# EAGLE design NixieDriver (EAGLE 9.6.2)
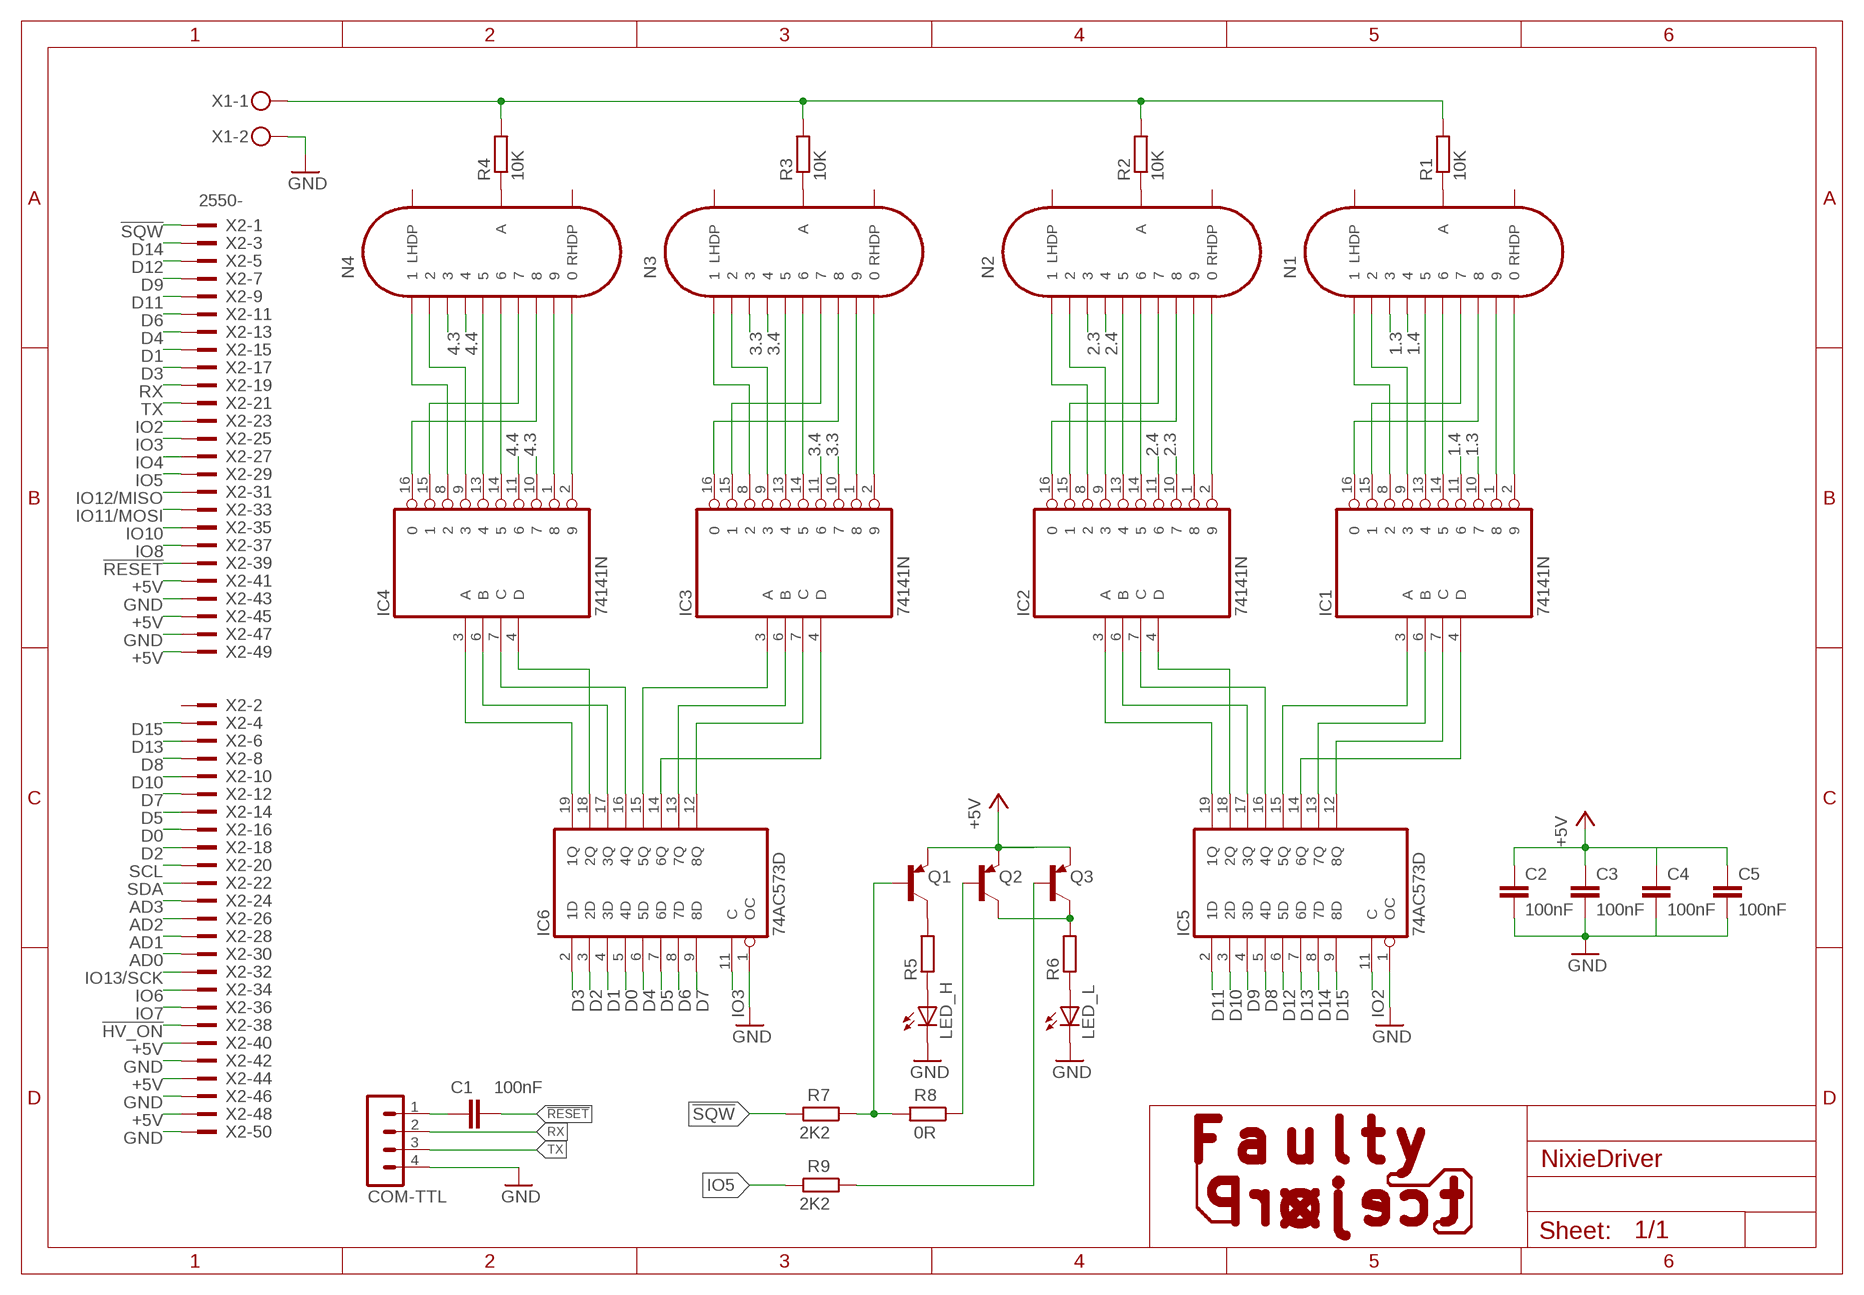
[diagram p0: schematic, sheet 1]

## Parts
C1  100nF  C-EUC1210  [C1210]
C2  100nF  C-EUC1210  [C1210]
C3  100nF  C-EUC1210  [C1210]
C4  100nF  C-EUC1210  [C1210]
C5  100nF  C-EUC1210  [C1210]
COM-TTL  MA04-1  [MA04-1]
IC1  74141N  [DIL16]
IC2  74141N  [DIL16]
IC3  74141N  [DIL16]
IC4  74141N  [DIL16]
IC5  74AC573D  [SO20W]
IC6  74AC573D  [SO20W]
LED_H  LED5MM  [LED5MM]
LED_L  LED5MM  [LED5MM]
N1  IN-14  [IN-14]
N2  IN-14  [IN-14]
N3  IN-14  [IN-14]
N4  IN-14  [IN-14]
Q1  BF621-PNP-SOT98-BCE  [SOT89-BCE]
Q2  BF621-PNP-SOT98-BCE  [SOT89-BCE]
Q3  BF621-PNP-SOT98-BCE  [SOT89-BCE]
R1  10K  R-EU_0309/V  [0309V]
R2  10K  R-EU_0309/V  [0309V]
R3  10K  R-EU_0309/V  [0309V]
R4  10K  R-EU_0309/V  [0309V]
R5  R-EU_M1206  [M1206]
R6  R-EU_M1206  [M1206]
R7  2K2  R-EU_M1406  [M1406]
R8  0R  R-EU_M1406  [M1406]
R9  2K2  R-EU_M1206  [M1206]
X1  MKDSN1,5/2-5,08  [MKDSN1,5/2-5,08]
X2  2550-  [PAK100/2500-50]

## Nets
1.0: IC1.2 N1.0
1.1: IC1.8 N1.1
1.2: IC1.9 N1.2
1.3: IC1.10 N1.3
1.4: IC1.11 N1.4
1.5: IC1.13 N1.5
1.6: IC1.14 N1.6
1.7: IC1.15 N1.7
1.8: IC1.16 N1.8
1.9: IC1.1 N1.9
2.0: IC2.2 N2.0
2.1: IC2.8 N2.1
2.2: IC2.9 N2.2
2.3: IC2.10 N2.3
2.4: IC2.11 N2.4
2.5: IC2.13 N2.5
2.6: IC2.14 N2.6
2.7: IC2.15 N2.7
2.8: IC2.16 N2.8
2.9: IC2.1 N2.9
3.0: IC3.2 N3.0
3.1: IC3.8 N3.1
3.2: IC3.9 N3.2
3.3: IC3.10 N3.3
3.4: IC3.11 N3.4
3.5: IC3.13 N3.5
3.6: IC3.14 N3.6
3.7: IC3.15 N3.7
3.8: IC3.16 N3.8
3.9: IC3.1 N3.9
4.0: IC4.2 N4.0
4.1: IC4.8 N4.1
4.2: IC4.9 N4.2
4.3: IC4.10 N4.3
4.4: IC4.11 N4.4
4.5: IC4.13 N4.5
4.6: IC4.14 N4.6
4.7: IC4.15 N4.7
4.8: IC4.16 N4.8
4.9: IC4.1 N4.9
!HV_ON: X2.38
!RESET: C1.2 X2.39
!SQW: R7.2 X2.1
+5V: C2.1 C3.1 C4.1 C5.1 Q1.E Q2.E Q3.E X2.40 X2.41 X2.44 X2.45 X2.48 X2.49
AD0: X2.30
AD1: X2.28
AD2: X2.26
AD3: X2.24
D0: IC6.5(4D) X2.16
D1: IC6.4(3D) X2.15
D2: IC6.3(2D) X2.18
D3: IC6.2(1D) X2.17
D4: IC6.6(5D) X2.13
D5: IC6.7(6D) X2.14
D6: IC6.8(7D) X2.11
D7: IC6.9(8D) X2.12
D8: IC5.5(4D) X2.8
D9: IC5.4(3D) X2.7
D10: IC5.3(2D) X2.10
D11: IC5.2(1D) X2.9
D12: IC5.6(5D) X2.5
D13: IC5.7(6D) X2.6
D14: IC5.8(7D) X2.3
D15: IC5.9(8D) X2.4
GND [gnd]: C2.2 C3.2 C4.2 C5.2 COM-TTL.4 IC5.1(OC) IC6.1(OC) LED_H.K(C) LED_L.K(C) X1.2 X2.42 X2.43 X2.46 X2.47 X2.50
HIGH_VOLTAGE: R1.2 R2.2 R3.2 R4.2 X1.1
IO2: IC5.11(C) X2.23
IO3: IC6.11(C) X2.25
IO4: X2.27
IO5: R9.2 X2.29
IO6: X2.34
IO7: X2.36
IO8: X2.37
IO10: X2.35
IO11/MOSI: X2.33
IO12/MISO: X2.31
IO13/SCK: X2.32
N$1: IC2.3(A) IC5.19(1Q)
N$2: IC2.4(D) IC5.18(2Q)
N$3: IC2.6(B) IC5.17(3Q)
N$4: IC2.7(C) IC5.16(4Q)
N$5: IC1.3(A) IC5.15(5Q)
N$6: IC1.4(D) IC5.14(6Q)
N$7: IC1.6(B) IC5.13(7Q)
N$8: IC1.7(C) IC5.12(8Q)
N$9: IC4.3(A) IC6.19(1Q)
N$10: IC4.4(D) IC6.18(2Q)
N$11: IC4.6(B) IC6.17(3Q)
N$12: IC4.7(C) IC6.16(4Q)
N$13: IC3.3(A) IC6.15(5Q)
N$14: IC3.4(D) IC6.14(6Q)
N$15: IC3.6(B) IC6.13(7Q)
N$16: IC3.7(C) IC6.12(8Q)
N$17: Q1.C R5.2
N$18: LED_H.A R5.1
N$19: Q2.C Q3.C R6.2
N$21: LED_L.A R6.1
N$22: Q1.B R7.1 R8.2
N$23: C1.1 COM-TTL.1
N$24: Q2.B R8.1
N$76: N1.A R1.1
N$77: N2.A R2.1
N$78: N3.A R3.1
N$79: N4.A R4.1
N$88: Q3.B R9.1
RX: COM-TTL.2 X2.19
SCL: X2.20
SDA: X2.22
TX: COM-TTL.3 X2.21
Unconnected: N1.LHDP N1.RHDP N2.LHDP N2.RHDP N3.LHDP N3.RHDP N4.LHDP N4.RHDP X2.2

## Power pins joined to a net without a drawn wire
+5V: IC1.5(VCC) IC2.5(VCC) IC3.5(VCC) IC4.5(VCC) IC5.20(VCC) IC6.20(VCC)
GND: IC1.12(GND) IC2.12(GND) IC3.12(GND) IC4.12(GND) IC5.10(GND) IC6.10(GND)

## Library data of the parts
C1-C5 = rcl:C-EU: CAPACITOR, European symbol
COM-TTL = con-lstb:MA04-1: PIN HEADER; OC_FARNELL: unknown; OC_NEWARK: unknown
IC1-IC4 = 74xx-eu:74*141: BCD to decimal DECODER/DRIVER
IC5 IC6 = 74xx-eu:74*573: 8-bit D latch BUS DRIVER
LED_H LED_L = led:LED: LED OSRAM: - CHIPLED LG R971, LG N971, LY N971, LG Q971, LY Q971, LO R971, LY R971 LH N974, LH R974 LS Q976, LO Q976, LY Q976 LO Q996 - Hyper CHIPLED LW Q18S LB Q993, LB Q99A, LB R99A - SideLED LS A670, LO A670, LY A670, LG A670, LP A670 LB A673, LV A673, LT A673, LW A673 LH A674 LY A675 LS A676, LA A676, LO A676, LY A676, LW A676 LS A679, LY A679, LG A679 - Hyper Micro SIDELED® LS Y876, LA Y876, LO Y876, LY Y876 LT Y87S - SmartLED LW L88C, LW L88S LB L89C, LB L89S, LG L890 LS L89K, LO L89K, LY L89K LS L896, LA L896, LO L896, LY L896 - TOPLED LS T670, LO T670, LY T670, LG T670, LP T670 LSG T670, LSP T670, LSY T670, LOP T670, LYG T670 LG T671, LOG T671, LSG T671 LB T673, LV T673, LT T673, LW T673 LH T674 LS T676, LA T676, LO T676, LY T676, LB T676, LH T676, LSB T676, LW T676 LB T67C, LV T67C, LT T67C, LS T67K, LO T67K, LY T67K, LW E67C LS E67B, LA E67B, LO E67B, LY E67B, LB E67C, LV E67C, LT E67C LW T67C LS T679, LY T679, LG T679 LS T770, LO T770, LY T770, LG T770, LP T770 LB T773, LV T773, LT T773, LW T773 LH T774 LS E675, LA E675, LY E675, LS T675 LS T776, LA T776, LO T776, LY T776, LB T776 LHGB T686 LT T68C, LB T68C - Hyper Mini TOPLED® LB M676 - Mini TOPLED Santana® LG M470 LS M47K, LO M47K, LY M47K Source: http://www.osram.convergy.de LUXEON: - LUMILED® LXK2-PW12-R00, LXK2-PW12-S00, LXK2-PW14-U00, LXK2-PW14-V00 LXK2-PM12-R00, LXK2-PM12-S00, LXK2-PM14-U00 LXK2-PE12-Q00, LXK2-PE12-R00, LXK2-PE12-S00, LXK2-PE14-T00, LXK2-PE14-U00 LXK2-PB12-K00, LXK2-PB12-L00, LXK2-PB12-M00, LXK2-PB14-N00, LXK2-PB14-P00, LXK2-PB14-Q00 LXK2-PR12-L00, LXK2-PR12-M00, LXK2-PR14-Q00, LXK2-PR14-R00 LXK2-PD12-Q00, LXK2-PD12-R00, LXK2-PD12-S00 LXK2-PH12-R00, LXK2-PH12-S00 LXK2-PL12-P00, LXK2-PL12-Q00, LXK2-PL12-R00 Source: www.luxeon.com KINGBRIGHT: KA-3528ASYC Source: www.kingbright.com
N1-N4 = russian-nixies:IN-14: IN-14: medium numeric frontview nixie tube
Q1-Q3 = transistor:*-PNP-: PNP Transistror
R1-R9 = rcl:R-EU_: RESISTOR, European symbol
X1 = con-phoenix-508:MKDSN1,5/2-5,08: MKDSN 1,5/ 2-5,08 Printklemme Nennstrom: 13,5 A Nennspannung: 250 V Rastermaß: 5,08 mm Polzahl: 2 Anschlussart: Schraubanschluss Montage: Löten Anschlussrichtung Leiter/Platine: 0 ° Artikelnummer: 1729128 Source: http://eshop.phoenixcontact.com .. 1729128.pdf
X2 = con-3m:2550-: 3M (TM) Pak 100 4-Wall Header Source: 3M; OC_FARNELL: unknown; OC_NEWARK: unknown

## Net classes
0 default: width 0.254 mm, clearance 0.254 mm
2 gnd: width 0.305 mm, drill 0.559 mm, clearance 0.254 mm
3 usbvcc: width 0.508 mm, drill 0.61 mm, clearance 0.254 mm

## Board
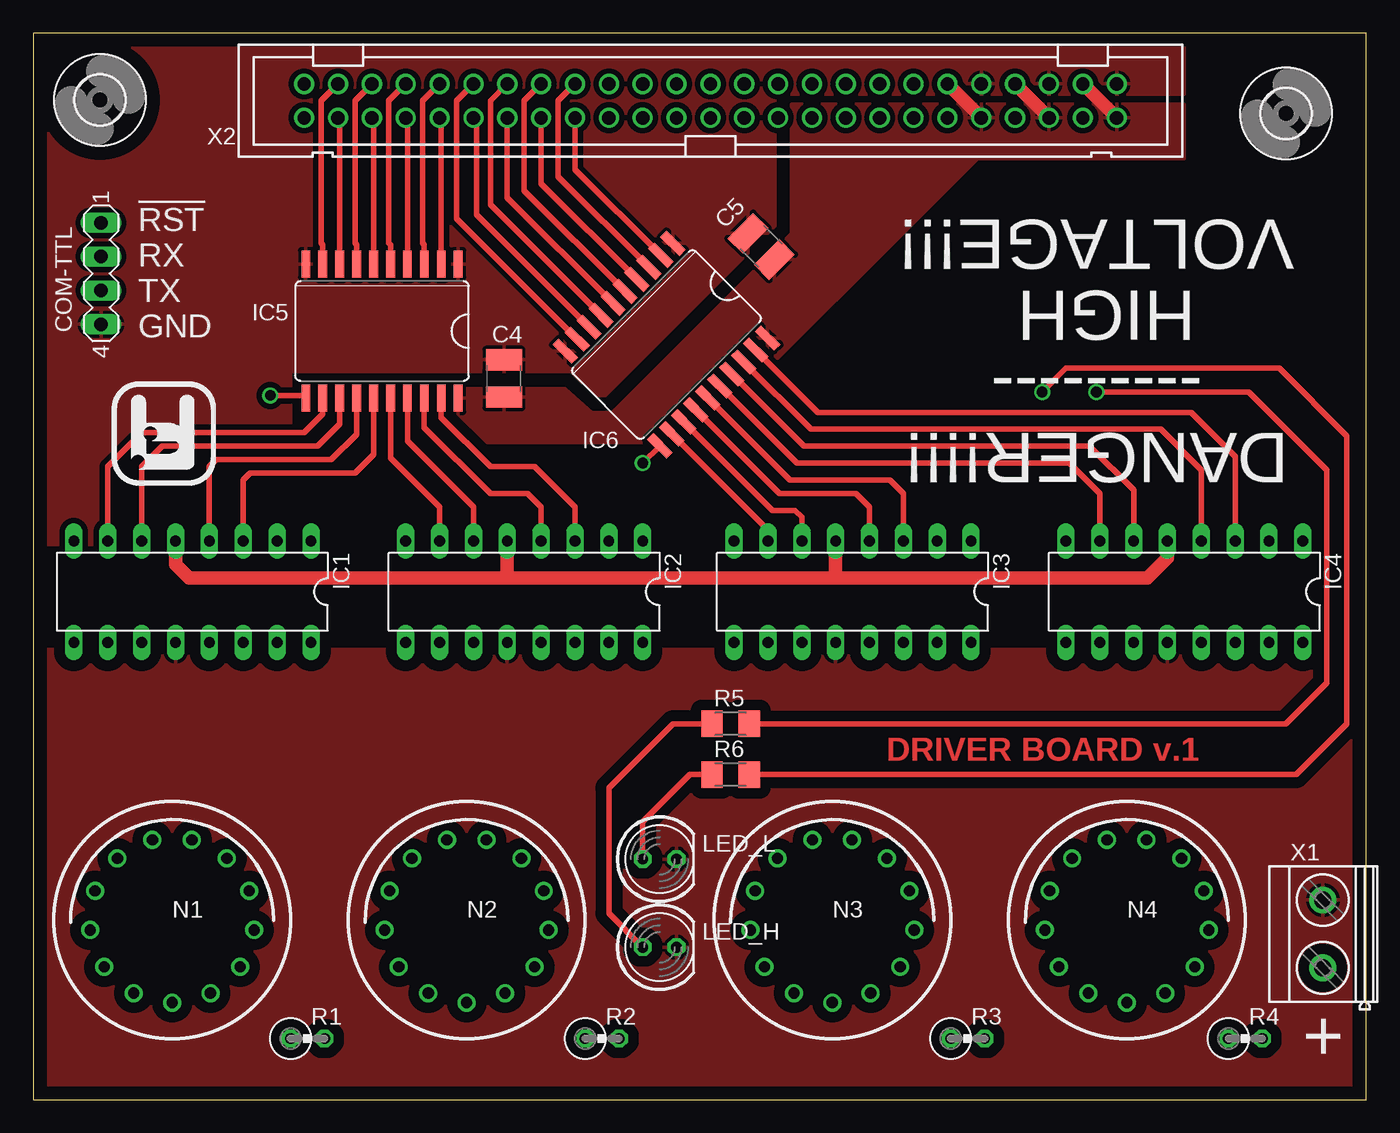
[diagram p1: board, top side]
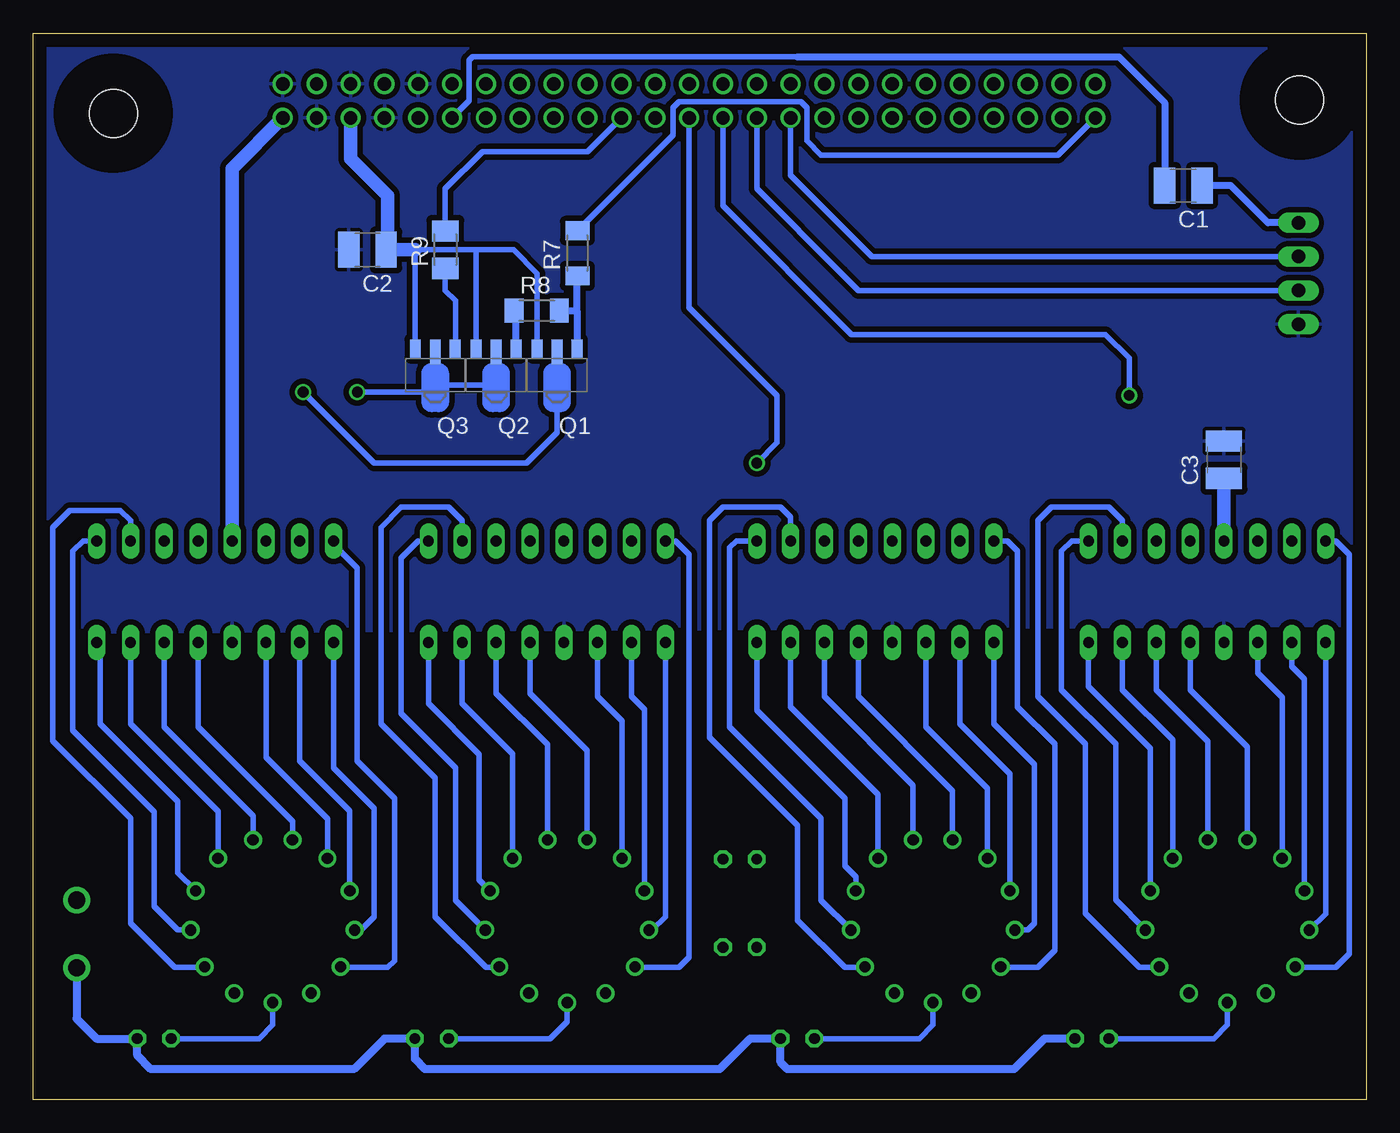
[diagram p2: board, bottom side, seen from below]

Size 100 x 80 mm. Coordinates in mm from the lower left corner, seen from the top.
Outline: 0,0 100,0 100,80 0,80 0,0
Copper layers (1*16): Top 0.035mm / dielectric 1.5mm / Bottom 0.035mm
Design rules "default": minimum track width 10mil, minimum drill 24mil, track to track 8mil, track to pad 8mil, pad to pad 8mil, via to via 8mil, smd to smd 8mil, copper to edge 40mil, drill to drill 8mil, minimum pad ring 10mil, minimum via ring 8mil, stop-mask expansion 4mil, vias tented up to drill 0mil, thermal gap 10mil

### Footprints (pad centres in the part's own frame; a part is rotated, then mirrored left to right if it is on the bottom)
C1210 = smd 1.6 x 2.7: 1 -1.4,0; 2 1.4,0
MA04-1 = drill 1.016 long: 1 -3.81,0; 2 -1.27,0; 3 1.27,0; 4 3.81,0
DIL16 = drill 0.813 long: 1 -8.89,-3.81; 2 -6.35,-3.81; 3 -3.81,-3.81; 4 -1.27,-3.81; 5 1.27,-3.81; 6 3.81,-3.81; 7 6.35,-3.81; 8 8.89,-3.81; 9 8.89,3.81; 10 6.35,3.81; 11 3.81,3.81; 12 1.27,3.81; 13 -1.27,3.81; 14 -3.81,3.81; 15 -6.35,3.81; 16 -8.89,3.81
SO20W = smd 0.66 x 2.032: 1 -5.715,-5.029; 2 -4.445,-5.029; 3 -3.175,-5.029; 4 -1.905,-5.029; 5 -0.635,-5.029; 6 0.635,-5.029; 7 1.905,-5.029; 8 3.175,-5.029; 9 4.445,-5.029; 10 5.715,-5.029; 11 5.715,5.029; 12 4.445,5.029; 13 3.175,5.029; 14 1.905,5.029; 15 0.635,5.029; 16 -0.635,5.029; 17 -1.905,5.029; 18 -3.175,5.029; 19 -4.445,5.029; 20 -5.715,5.029
LED5MM = drill 0.813 octagon: A -1.27,0; K 1.27,0
IN-14 = drill 0.84: 0 5.094,-3.516; 1 -5.094,-3.516; 2 -6.145,-0.746; 3 -5.788,2.195; 4 -4.105,4.633; 5 -1.481,6.01; 6 1.481,6.01; 7 4.105,4.633; 8 5.788,2.195; 9 6.145,-0.746; A 0,-6.19; LHDP 2.877,-5.481; RHDP -2.877,-5.481
SOT89-BCE = smd 0.8 x 1.4: B -1.499,-1.981; E 1.499,-1.981 | smd 0.8 x 1.9: C 0,-1.727
0309V = drill 0.813 octagon: 1 -1.27,0; 2 1.27,0
M1206 = smd 1.6 x 2: 1 -1.4,0; 2 1.4,0
M1406 = smd 1.4 x 1.8: 1 -1.7,0; 2 1.7,0
3,6 = hole 3.6: 0,0
MKDSN1,5/2-5,08 = drill 1.3 pad 2: 1 -2.561,0.025; 2 2.519,0.025
PAK100/2500-50 = drill 1 pad 1.422: 1 -30.48,-1.27; 2 -30.48,1.27; 3 -27.94,-1.27; 4 -27.94,1.27; 5 -25.4,-1.27; 6 -25.4,1.27; 7 -22.86,-1.27; 8 -22.86,1.27; 9 -20.32,-1.27; 10 -20.32,1.27; 11 -17.78,-1.27; 12 -17.78,1.27; 13 -15.24,-1.27; 14 -15.24,1.27; 15 -12.7,-1.27; 16 -12.7,1.27; 17 -10.16,-1.27; 18 -10.16,1.27; 19 -7.62,-1.27; 20 -7.62,1.27; 21 -5.08,-1.27; 22 -5.08,1.27; 23 -2.54,-1.27; 24 -2.54,1.27; 25 0,-1.27; 26 0,1.27; 27 2.54,-1.27; 28 2.54,1.27; 29 5.08,-1.27; 30 5.08,1.27; 31 7.62,-1.27; 32 7.62,1.27; 33 10.16,-1.27; 34 10.16,1.27; 35 12.7,-1.27; 36 12.7,1.27; 37 15.24,-1.27; 38 15.24,1.27; 39 17.78,-1.27; 40 17.78,1.27; 41 20.32,-1.27; 42 20.32,1.27; 43 22.86,-1.27; 44 22.86,1.27; 45 25.4,-1.27; 46 25.4,1.27; 47 27.94,-1.27; 48 27.94,1.27; 49 30.48,-1.27; 50 30.48,1.27

### Placement (x,y rotation side)
C1  13.72,68.58 180 bottom
C2  74.93,63.75 180 bottom
C3  10.67,48.01 90 bottom
C4  35.31,54.1 90 top
C5  54.61,64.01 135 top
COM-TTL  5.08,61.98 270 top
IC1  11.94,38.1 180 top
IC2  36.83,38.1 180 top
IC3  61.47,38.1 180 top
IC4  86.36,38.1 180 top
IC5  26.16,57.66 180 top
IC6  47.5,56.64 225 top
LED_H  46.99,11.43 0 top
LED_L  46.99,18.03 0 top
N1  10.41,13.46 0 top
N2  32.51,13.46 0 top
N3  59.94,13.46 0 top
N4  82.04,13.46 0 top
Q1  60.71,54.36 180 bottom
Q2  65.28,54.36 180 bottom
Q3  69.85,54.36 180 bottom
R1  20.57,4.57 0 top
R2  42.67,4.57 0 top
R3  70.1,4.57 0 top
R4  90.93,4.57 0 top
R5  52.32,28.19 0 top
R6  52.32,24.38 0 top
R7  59.18,63.5 90 bottom
R8  62.23,59.18 0 bottom
R9  69.09,63.75 90 bottom
U$1  [3,6]  5,75 0 top
U$3  [3,6]  94,74 0 top
X1  96.77,12.45 90 top
X2  50.8,74.93 0 top

### Tracks (layer width: path | path; a pad name or v marks a point on that pad's centre or on a via)
1.0
  Bottom 0.406: IC1.2 18.29,43.43 19.3,44.45 23.62,44.45 24.64,43.43 24.64,30.23 21.08,26.67 21.08,13.97 17.02,9.91 15.55,9.91 N1.0
1.1
  Bottom 0.406: IC1.8 2.29,41.91 1.27,40.89 1.27,10.92 2.29,9.91 5.28,9.91 N1.1
1.2
  Bottom 0.406: IC1.9 3.05,13.94 N1.2
1.3
  Bottom 0.406: N1.3 4.63,31.55 5.59,32.51 IC1.10
1.4
  Bottom 0.406: N1.4 6.31,30.18 8.13,32 IC1.11
1.5
  Bottom 0.406: N1.5 8.93,26.46 13.21,30.73 IC1.13
1.6
  Bottom 0.406: N1.6 11.89,26.88 15.75,30.73 IC1.14
1.7
  Bottom 0.406: N1.7 14.52,26.96 18.29,30.73 IC1.15
1.8
  Bottom 0.406: N1.8 16.2,26.36 20.83,30.99 IC1.16
1.9
  Bottom 0.406: N1.9 16.56,12.75 18.8,14.99 18.8,26.67 22.86,30.73 22.86,41.15 22.1,41.91 IC1.1
2.0
  Bottom 0.406: N2.0 37.65,9.91 39.12,9.91 42.67,13.46 42.67,20.57 49.28,27.18 49.28,43.43 48.26,44.45 43.94,44.45 43.18,43.69 IC2.2
2.1
  Bottom 0.406: IC2.8 26.92,41.91 26.16,41.15 26.16,29.46 23.37,26.67 23.37,11.18 24.64,9.91 27.38,9.91 N2.1
2.2
  Bottom 0.406: N2.2 25.38,12.72 24.89,13.21 24.89,25.15 27.94,28.19 IC2.9
2.3
  Bottom 0.406: N2.3 26.72,24.44 30.48,28.19 IC2.10
2.4
  Bottom 0.406: N2.4 28.41,23.33 33.02,27.94 IC2.11
2.5
  Bottom 0.406: N2.5 31.03,23.16 38.1,30.23 IC2.13
2.6
  Bottom 0.406: N2.6 33.99,23.58 40.64,30.23 IC2.14
2.7
  Bottom 0.406: N2.7 36.62,22.9 43.18,29.46 IC2.15
2.8
  Bottom 0.406: N2.8 38.3,16.71 39.12,17.53 39.12,22.61 45.72,29.21 IC2.16
2.9
  Bottom 0.406: N2.9 40.89,14.95 40.89,21.08 47.75,27.94 47.75,41.4 47.24,41.91 IC2.1
3.0
  Bottom 0.406: N3.0 65.08,9.91 66.04,9.91 69.85,13.72 69.85,24.13 73.91,28.19 73.91,42.93 72.39,44.45 68.83,44.45 67.82,43.43 IC3.2
3.1
  Bottom 0.406: IC3.8 51.82,41.91 50.8,40.89 50.8,10.67 51.56,9.91 54.81,9.91 N3.1
3.2
  Bottom 0.406: N3.2 53.58,12.72 52.58,13.72 IC3.9
3.3
  Bottom 0.406: N3.3 54.16,29.26 55.12,30.23 IC3.10
3.4
  Bottom 0.406: N3.4 55.84,28.41 57.66,30.23 IC3.11
3.5
  Bottom 0.406: N3.5 58.46,26.2 62.74,30.48 IC3.13
3.6
  Bottom 0.406: N3.6 61.42,26.63 65.28,30.48 IC3.14
3.7
  Bottom 0.406: N3.7 64.05,25.95 67.82,29.72 IC3.15
3.8
  Bottom 0.406: N3.8 66.55,16.47 66.55,25.91 70.36,29.72 IC3.16
3.9
  Bottom 0.406: N3.9 68.33,14.95 68.33,24.89 72.39,28.96 72.39,40.64 71.12,41.91 IC3.1
4.0
  Bottom 0.406: N4.0 87.18,9.91 89.41,9.91 92.71,13.21 92.71,21.08 98.55,26.92 98.55,42.93 97.28,44.2 93.47,44.2 92.71,43.43 IC4.2
4.1
  Bottom 0.406: N4.1 76.91,9.91 73.41,9.91 72.9,10.41 72.9,22.61 75.69,25.4 75.69,39.88 77.72,41.91 IC4.8
4.2
  Bottom 0.406: IC4.9 77.47,24.89 74.42,21.84 74.42,13.72 75.42,12.72 N4.2
4.3
  Bottom 0.406: IC4.10 80.01,25.4 76.25,21.64 N4.3
4.4
  Bottom 0.406: IC4.11 82.55,25.65 77.94,21.04 N4.4
4.5
  Bottom 0.406: IC4.13 87.63,27.94 80.56,20.87 N4.5
4.6
  Bottom 0.406: IC4.14 90.17,27.94 83.52,21.29 N4.6
4.7
  Bottom 0.406: IC4.15 92.71,28.19 86.15,21.63 N4.7
4.8
  Bottom 0.406: IC4.16 95,34.04 95,28.19 89.15,22.35 89.15,17.02 87.83,15.69 N4.8
4.9
  Bottom 0.406: IC4.1 96.27,41.91 97.03,41.15 97.03,27.69 90.93,21.59 90.93,14.48 89.17,12.72 N4.9
!RESET
  Bottom 0.406: 42.67,78.23 67.06,78.23 67.31,77.98 67.31,74.93 X2.39
  Bottom 0.508: 42.67,78.23 18.54,78.23 15.12,74.81 C1.2
!SQW
  Bottom 0.406: R7.2 52.01,72.37 52.01,74.42 51.56,74.87 42.42,74.87 41.97,74.42 41.97,71.94 40.89,70.87 23.11,70.87 X2.1
+5V
  Top 1.016: IC1.5 10.67,40.13 11.68,39.12 35.56,39.12 | 35.56,39.12 60.2,39.12 | 60.2,39.12 83.57,39.12 85.09,40.64 IC4.5 | IC3.5 60.2,39.12 | IC2.5 35.56,39.12 | X2.40 X2.41 | X2.44 X2.45 | X2.48 X2.49
  Bottom 0.406: Q3.E 71.35,63.75 | Q2.E 66.78,63.75 | 66.78,63.75 71.35,63.75 | 66.78,63.75 63.98,63.75 62.2,61.98 Q1.E | 71.37,63.75 71.35,63.75
  Bottom 1.016: X2.49 85.09,69.85 IC4.5 | IC1.5 C3.1 | X2.45 76.2,70.61 73.41,67.82 73.41,63.88 C2.1 71.37,63.75
  pour Top (isolate 0.406): 86.36,74.68 86.36,70.61 70.87,70.61 49.53,49.28 34.04,49.28 31.75,51.56 31.75,53.34 39.91,53.34 41.91,51.56 43.43,51.56 56.9,65.02 56.9,74.68
D0
  Top 0.406: X2.16 36.83,74.93 36.83,68.21 IC6.5
D1
  Top 0.406: X2.15 38.1,68.73 IC6.4
D2
  Top 0.406: X2.18 39.37,74.93 39.37,69.26 IC6.3
D3
  Top 0.406: X2.17 40.64,69.79 IC6.2
D4
  Top 0.406: X2.13 35.56,67.68 IC6.6
D5
  Top 0.406: X2.14 34.29,74.93 34.29,67.16 IC6.7
D6
  Top 0.406: X2.11 33.27,73.41 33.27,66.38 IC6.8
D7
  Top 0.406: X2.12 31.75,74.93 31.75,66.1 IC6.9
D8
  Top 0.406: X2.8 26.67,74.93 26.67,64.26 26.8,64.14 IC5.5
D9
  Top 0.406: X2.7 28.07,73.53 IC5.4
D10
  Top 0.406: X2.10 29.21,74.93 29.21,64.26 29.34,64.14 IC5.3
D11
  Top 0.406: X2.9 30.61,73.53 IC5.2
D12
  Top 0.406: X2.5 25.53,73.53 IC5.6
D13
  Top 0.406: X2.6 24.13,74.93 24.13,64.26 24.26,64.14 IC5.7
D14
  Top 0.406: X2.3 22.99,73.53 IC5.8
D15
  Top 0.406: X2.4 21.59,74.93 21.59,64.26 21.72,64.14 IC5.9
GND
  pour Bottom (isolate 0.406): 0,35.56 99.82,35.05 99.82,80.01 0,80.01
  pour Top (isolate 0.813): 0,0 99.82,0 99.82,33.78 0,33.78
  pour Top (isolate 0.406): 0,80.01 86.36,80.01 86.36,75.44 55.63,75.44 55.63,65.53 42.93,52.83 42.16,52.83 40.35,54.61 19.3,54.61 19.3,41.66 0,41.66
HIGH_VOLTAGE
  Bottom 0.61: X1.1 96.75,6.07 95.25,4.57 R4.2 92.2,3.3 91.19,2.29 75.95,2.29 73.66,4.57 R3.2 71.37,3.05 70.61,2.29 48.51,2.29 46.23,4.57 R2.2 43.94,2.79 43.43,2.29 26.42,2.29 24.13,4.57 R1.2
IO2  (via drill 0.8)
  Top 0.406: v17.78,52.83 20.24,52.83 IC5.11
  Bottom 0.406: X2.23 48.26,67.06 38.61,57.4 19.56,57.4 17.78,55.63 v17.78,52.83
IO3  (via drill 0.8 pad 1.02)
  Top 0.406: IC6.11 | v45.72,47.75 | v45.72,47.75 IC6.11
  Bottom 0.406: X2.25 50.8,59.44 44.2,52.83 44.2,49.28 v45.72,47.75
IO5
  Bottom 0.406: X2.29 58.42,71.12 66.29,71.12 69.09,68.33 R9.2
N$1
  Top 0.406: IC5.19 30.61,51.18 34.29,47.5 37.59,47.5 40.64,44.45 IC2.3
N$2
  Top 0.406: IC5.18 29.34,50.42 34.29,45.47 37.08,45.47 38.1,44.45 IC2.4
N$3
  Top 0.406: IC5.17 28.07,49.4 33.02,44.45 IC2.6
N$4
  Top 0.406: IC5.16 26.8,48.13 30.48,44.45 IC2.7
N$5
  Top 0.406: IC5.15 25.53,48.39 24.13,46.99 16.26,46.99 15.75,46.48 IC1.3
N$6
  Top 0.406: IC5.14 24.26,49.91 22.35,48.01 13.72,48.01 13.21,47.5 IC1.4
N$7
  Top 0.406: IC5.13 22.99,50.67 21.34,49.02 9.65,49.02 8.13,47.5 IC1.6
N$8
  Top 0.406: IC5.12 21.72,51.44 20.32,50.04 8.13,50.04 5.59,47.5 IC1.7
N$9
  Top 0.406: IC4.3 90.17,48.26 86.87,51.56 58.86,51.56 IC6.19
N$10
  Top 0.406: IC4.4 87.63,47.24 84.58,50.29 58.34,50.29 IC6.18
N$11
  Top 0.406: IC4.6 82.55,45.72 79.25,49.02 57.81,49.02 IC6.17
N$12
  Top 0.406: IC4.7 80.01,45.47 77.72,47.75 57.29,47.75 IC6.16
N$13
  Top 0.406: IC3.3 65.28,45.47 64.26,46.48 56.76,46.48 IC6.15
N$14
  Top 0.406: IC3.4 62.74,44.45 61.72,45.47 55.98,45.47 IC6.14
N$15
  Top 0.406: IC3.6 57.66,43.69 57.15,44.2 55.45,44.2 IC6.13
N$16
  Top 0.406: IC3.7 55.12,42.74 IC6.12
N$17  (via drill 0.8)
  Top 0.406: R5.2 93.98,28.19 97.03,31.24 97.03,47.24 91.19,53.09 v79.76,53.09
  Bottom 0.406: v79.76,53.09 74.42,47.75 62.99,47.75 60.71,50.04 Q1.C
N$18
  Top 0.406: R5.1 48.01,28.19 43.18,23.37 43.18,13.97 LED_H.A
N$19  (via drill 0.8)
  Top 0.406: R6.2 94.74,24.38 98.55,28.19 98.55,49.78 93.47,54.86 77.47,54.86 v75.69,53.09
  Bottom 0.406: Q2.C 65.28,54.1 65.79,53.59 69.09,53.59 69.47,53.98 | 69.47,53.98 69.85,54.36 Q3.C | v75.69,53.09 70.36,53.09 69.47,53.98
N$21
  Top 0.406: R6.1 49.28,24.38 45.72,20.83 LED_L.A
N$22
  Bottom 0.406: R7.1 59.21,61.77
  Bottom 0.508: 59.21,59.18 Q1.B | R8.2 59.21,59.18 | 59.21,59.18 59.21,61.77
N$23
  Bottom 0.508: COM-TTL.1 7.37,65.79 10.16,68.58 C1.1
N$24
  Bottom 0.508: Q2.B 63.78,59.18 R8.1
N$76
  Bottom 0.406: R1.1 11.43,4.57 10.41,5.59 N1.A
N$77
  Bottom 0.406: R2.1 33.53,4.57 32.51,5.59 N2.A
N$78
  Bottom 0.406: R3.1 61.21,4.57 59.94,5.84 N3.A
N$79
  Bottom 0.406: R4.1 83.06,4.57 82.04,5.59 N4.A
N$88
  Bottom 0.406: R9.1 69.09,60.71 68.33,59.94 68.33,56.36 Q3.B
RX
  Bottom 0.406: X2.19 43.18,69.34 37.08,63.25 COM-TTL.2
TX
  Bottom 0.406: X2.21 45.72,68.33 39.4,62.01 38.1,60.71 COM-TTL.3

### Text on the board
Top: DRIVER BOARD v.1
tPlace: !RST / RX / TX / GND
tNames: DANGER!!!! / --------- / HIGH / VOLTAGE!!! | +